# Altium schematic sheet Connector_and_Protection.SchDoc
size A4; SheetNumber: 6; SheetTotal: 6; SPICEModelCacheQSURVNTY: <root> / <DocumentId>QSURVNTY</DocumentId> / <CacheFrame Number="0"> / <Model Name="led0" Kind="MDL"> / <Text>*Typ INFRARED GaAs LED: Vf=1.2V Vr=5V If=40mA trr=3uS / *LED Pinout: 1=A, 2=K / .MODEL LED0 D (IS=93.5P RS=84M N=2.63 BV=5 IBV=10U / + CJO=2.97P VJ=.75 M=.333 TT=4.32U)</Text> / </Model> / </CacheFrame> / </root>
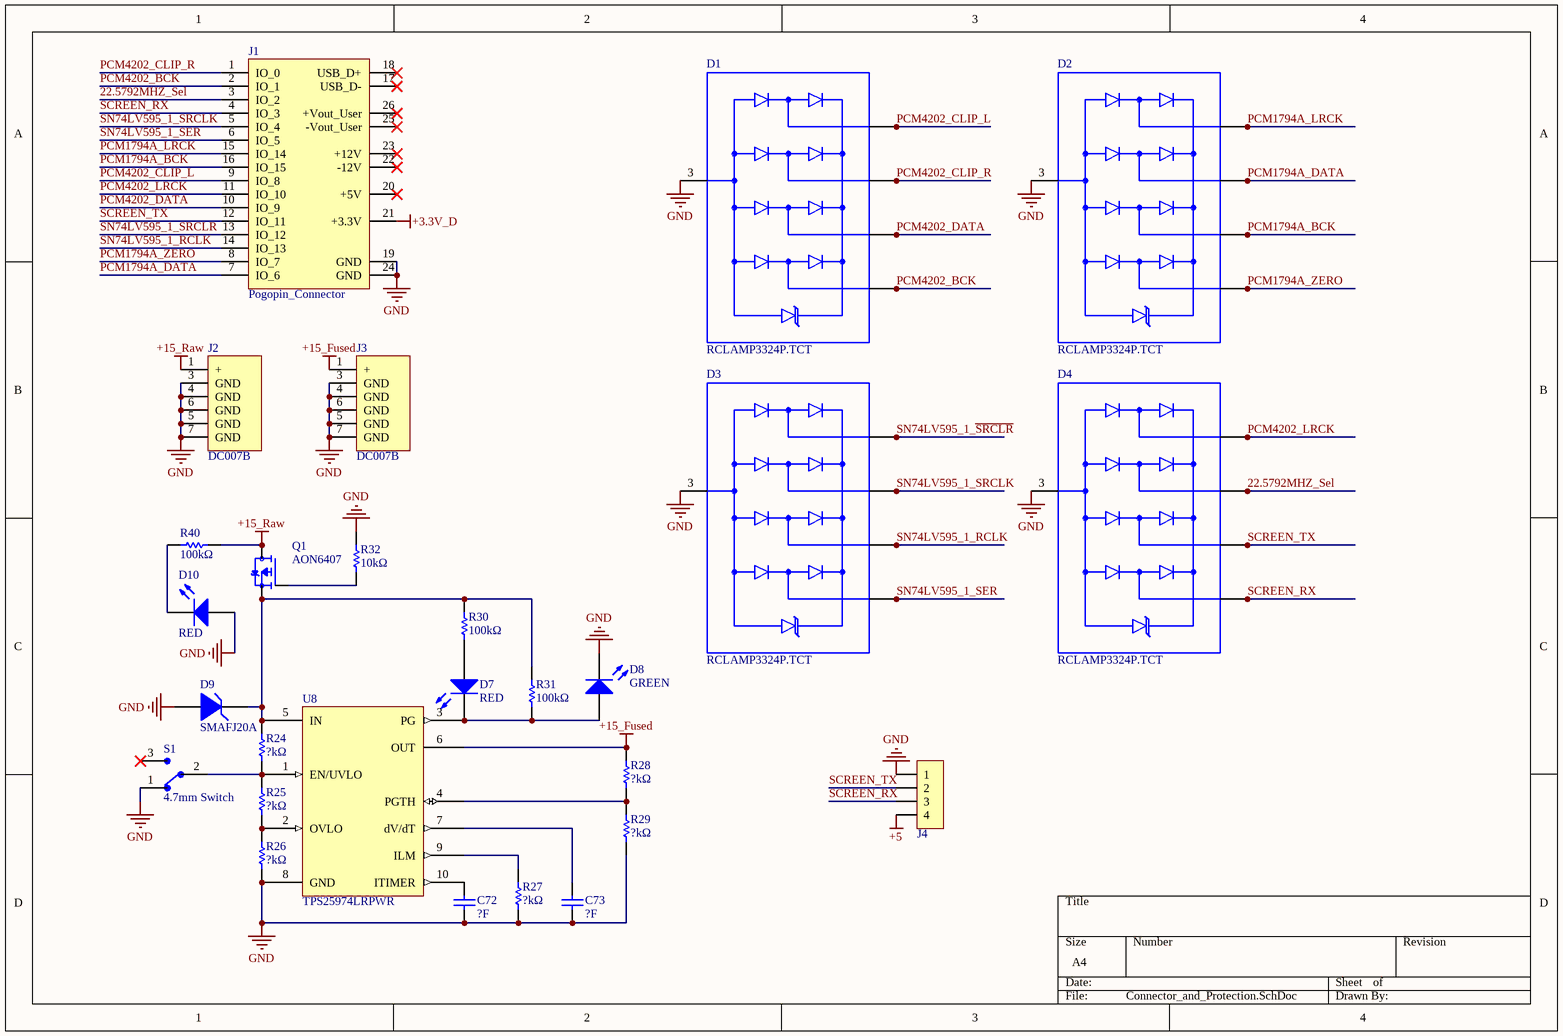
[diagram p0: Connector_and_Protection.SchDoc]

## Parts
C72  ?F  [C 0402_L]
C73  ?F  [C 0402_L]
D1  RCLAMP3324P.TCT  [DIO_RCLAMP3324P.TCT]
D2  RCLAMP3324P.TCT  [DIO_RCLAMP3324P.TCT]
D3  RCLAMP3324P.TCT  [DIO_RCLAMP3324P.TCT]
D4  RCLAMP3324P.TCT  [DIO_RCLAMP3324P.TCT]
D7  RED  [LED 0603R]
D8  GREEN  [LED 0603B]
D9  SMAFJ20A  [VISH-DO-214AC-2_L]
D10  RED  [LED 0603R]
J1  Pogopin_Connector  [26P_Pogopin]
J2  DC007B  [CONN2_ADC-096-2-T/R_ADM]
J3  DC007B  [CONN2_ADC-096-2-T/R_ADM]
J4  HDR-1X4  [XH2.54-WI-4P]  (value not drawn)
Q1  AON6407  [TRANS_AON6407]
R24  ?kΩ  [R 0402_L]
R25  ?kΩ  [R 0402_L]
R26  ?kΩ  [R 0402_L]
R27  ?kΩ  [R 0402_L]
R28  ?kΩ  [R 0402_L]
R29  ?kΩ  [R 0402_L]
R30  100kΩ  [R 0402_L]
R31  100kΩ  [R 0402_L]
R32  10kΩ  [R 0402_L]
R40  100kΩ  [R 0402_L]
S1  4.7mm Switch  [SW_1101M2S3CQE2]
U8  TPS25974LRPWR  [VQFN8_PWR_TEX]

## Nets
+3.3V_D: J1.21(+3.3V)
+5: J4.4
+15_Fused: J3.1(+) R28.2 U8.6(OUT)
+15_Raw: J2.1(+) Q1.5_8(D) R40.1
GND: C72.2 C73.2 D1.3(GND) D2.3(GND) D3.3(GND) D4.3(GND) D8.2(K) D9.2(A) D10.1(A) J1.19(GND) J1.24(GND) J2.3(GND) J2.4(GND) J2.5(GND) J2.6(GND) J2.7(GND) J3.3(GND) J3.4(GND) J3.5(GND) J3.6(GND) J3.7(GND) J4.1 R26.1 R27.1 R29.1 R32.1 S1.1 U8.8(GND)
22.5792MHZ_Sel: D4.2 J1.3(IO_2)
PCM1794A_BCK: D2.4 J1.16(IO_15)
PCM1794A_DATA: D2.2 J1.7(IO_6)
PCM1794A_LRCK: D2.1 J1.15(IO_14)
PCM1794A_ZERO: D2.5 J1.8(IO_7)
PCM4202_BCK: D1.5 J1.2(IO_1)
PCM4202_CLIP_L: D1.1 J1.9(IO_8)
PCM4202_CLIP_R: D1.2 J1.1(IO_0)
PCM4202_DATA: D1.4 J1.10(IO_9)
PCM4202_LRCK: D4.1 J1.11(IO_10)
SCREEN_RX: D4.5 J1.4(IO_3) J4.3
SCREEN_TX: D4.4 J1.12(IO_11) J4.2
SN74LV595_1_RCLK: D3.4 J1.14(IO_13)
SN74LV595_1_~{SRCLR}: D3.1 J1.13(IO_12)
SN74LV595_1_SER: D3.5 J1.6(IO_5)
SN74LV595_1_SRCLK: D3.2 J1.5(IO_4)
NetC72_1: C72.1 U8.10(ITIMER)
NetC73_1: C73.1 U8.7(dV/dT)
NetD7_1: D7.1(A) R30.1
NetD7_2: D7.2(K) D8.1(A) R31.1 U8.3(PG)
NetD9_1: D9.1(K) Q1.1(S) Q1.2(S) Q1.3(S) R24.2 R30.2 R31.2 U8.5(IN)
NetD10_2: D10.2(K) R40.2
NetQ1_4: Q1.4(G) R32.2
NetR24_1: R24.1 R25.2 S1.2 U8.1(EN/UVLO)
NetR25_1: R25.1 R26.2 U8.2(OVLO)
NetR27_2: R27.2 U8.9(ILM)
NetR28_1: R28.1 R29.2 U8.4(PGTH)

Not connected (* = marked no-connect by the designer): J1 17(USB_D-)* 18(USB_D+)* 20(+5V)* 22(-12V)* 23(+12V)* 25(-Vout_User)* 26(+Vout_User)*; S1 3*

## Library data of the parts
C72 C73 = Cap: Capacitor; Value: 10uF; Published: 8-Jun-2000; LatestRevisionDate: 17-Jul-2002; LatestRevisionNote: Re-released for DXP Platform.; PackageReference: RAD-0.3; Publisher: Altium Limited; PackageDescription: Radial Cap, Thru-Hole; 2 Leads; 0.3 in Pin Spacing
D1-D4 = RCLAMP3324P.TCT: 4.5V Clamp 4.5A _8/20Âµs_ Ipp Tvs Diode Surface Mount SGP2510P8; MF: Semtech Corporation; Price: None; Value: *; Package: UFDFN-8 Semtech; Availability: Unavailable; SnapEDA_Link: https://www.snapeda.com/parts/RCLAMP3324P.TCT/Semtech%20Corporation/view-part/754476/?ref=snap; MP: RCLAMP3324P.TCT
D7 D8 D10 = LED0: Typical INFRARED GaAs LED; Published: 8-Jun-2000; LatestRevisionDate: 08-Jul-2005; LatestRevisionNote: Mech Layer 1 removed.; PackageReference: LED-0; Publisher: Altium Limited; PackageDescription: LED; 2 Leads
D9 = CMP-0548-00226-2
J1 = Pogopin_Connector: Pogopin connector suits Raindrop-S
J2 J3 = DC007B: 5521; Mfr_Name: ADAM TECHNOLOGIES INC; Manufacturer_Part_Number: ADC-096-2-T/R; Copyright: Copyright (C) 2022 Ultra Librarian. All rights reserved.; RefDes: RefDes; Type: DEV
J4 = Header 4: BOM名称: 4P接插件; 淘宝ID: 小糖豆的小窝窝; 下单链接: https://item.taobao.com/item.htm?ft=t&id=613637044352
Q1 = AON6407: P-Channel 30V 32A (Ta), 85A (Tc) 7.3W (Ta), 83W (Tc) Surface Mount 8-DFN (5x6); MF: Alpha &; SnapEDA_Link: https://www.snapeda.com/parts/AON6407/Alpha%20&%20Omega%20Semiconductor%20Inc./view-part/2658357/?ref=snap; MP: AON6407; Value: *; Digi-Key_Part_Number: 785-1421-1-ND; Check_prices: https://www.snapeda.com/parts/AON6407/Alpha%20&%20Omega%20Semiconductor%20Inc./view-part/2658357/?ref=eda; Package: DFN-8 Alpha &amp; Omega Semiconductor
R24-R32 R40 = Res1: Resistor; Value: 43K; Published: 8-Jun-2000; LatestRevisionDate: 17-Jul-2002; LatestRevisionNote: Re-released for DXP Platform.; PackageReference: AXIAL-0.3; Publisher: Altium Limited; PackageDescription: Axial Device, Thru-Hole; 2 Leads; 0.3 in Pin Spacing
S1 = 4.7mm Switch: Slide Switch SPDT Through Hole; MP: 1101M2S3CQE2; MF: C&K; SnapEDA_Link: https://www.snapeda.com/parts/1101M2S3CQE2/C%26K/view-part/287375/?ref=snap; Value: *; Digi-Key_Part_Number: CKN5001-ND; Digi-Key_Purchase_URL: https://www.digikey.fr/product-detail/en/c-k/1101M2S3CQE2/CKN5001-ND/67042?utm_source=snapeda&utm_medium=aggregator&utm_campaign=symbol; Package: None
U8 = TPS25974LRPWR: No Description Available; Mfr_Name: Texas Instruments; RefDes: RefDes; Type: Type